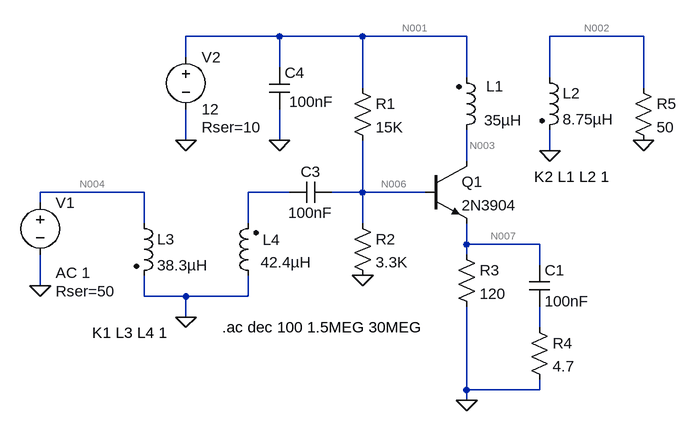
[diagram p0: schematic 2n3904 2_amp.asc]
2n3904 2_amp.asc, the LTspice schematic file:
Version 4
SHEET 1 976 740
WIRE -16 112 -160 112
WIRE 112 112 -16 112
WIRE 272 112 112 112
WIRE 544 112 400 112
WIRE -160 144 -160 112
WIRE -16 160 -16 112
WIRE 272 176 272 112
WIRE 400 176 400 112
WIRE 112 192 112 112
WIRE 544 192 544 112
WIRE -160 272 -160 224
WIRE -16 272 -16 224
WIRE 400 288 400 256
WIRE 272 304 272 256
WIRE -224 352 -384 352
WIRE 0 352 -64 352
WIRE 112 352 112 272
WIRE 112 352 64 352
WIRE 208 352 112 352
WIRE -384 368 -384 352
WIRE -224 400 -224 352
WIRE -64 400 -64 352
WIRE 112 400 112 352
WIRE 272 432 272 400
WIRE 384 432 272 432
WIRE 272 448 272 432
WIRE 384 464 384 432
WIRE -384 496 -384 448
WIRE -224 512 -224 480
WIRE -160 512 -224 512
WIRE -64 512 -64 480
WIRE -64 512 -160 512
WIRE -160 544 -160 512
WIRE 384 560 384 528
WIRE 272 656 272 528
WIRE 384 656 384 640
WIRE 384 656 272 656
WIRE 272 672 272 656
FLAG -384 496 0
FLAG 112 480 0
FLAG 272 672 0
FLAG 400 288 0
FLAG -16 272 0
FLAG 544 272 0
FLAG -160 272 0
FLAG -160 544 0
SYMBOL voltage -384 352 R0
WINDOW 123 24 124 Left 2
WINDOW 39 24 152 Left 2
SYMATTR Value2 AC 1
SYMATTR SpiceLine Rser=50
SYMATTR InstName V1
SYMATTR Value ""
SYMBOL res 96 176 R0
SYMATTR InstName R1
SYMATTR Value 15K
SYMBOL res 96 384 R0
SYMATTR InstName R2
SYMATTR Value 3.3K
SYMBOL res 256 432 R0
SYMATTR InstName R3
SYMATTR Value 120
SYMBOL npn 208 304 R0
SYMATTR InstName Q1
SYMATTR Value 2N3904
SYMBOL cap 64 336 R90
WINDOW 0 0 32 VBottom 2
WINDOW 3 32 32 VTop 2
SYMATTR InstName C3
SYMATTR Value 100nF
SYMBOL ind2 256 272 M180
WINDOW 0 46 83 Left 2
WINDOW 3 43 31 Left 2
SYMATTR InstName L1
SYMATTR Value 35µH
SYMATTR Type ind
SYMBOL ind2 384 160 R0
SYMATTR InstName L2
SYMATTR Value 8.75µH
SYMATTR Type ind
SYMBOL cap -32 160 R0
WINDOW 3 31 53 Left 2
SYMATTR Value 100nF
SYMATTR InstName C4
SYMBOL res 528 176 R0
SYMATTR InstName R5
SYMATTR Value 50
SYMBOL voltage -160 128 R0
WINDOW 123 0 0 Left 0
WINDOW 39 24 124 Left 2
SYMATTR SpiceLine Rser=10
SYMATTR InstName V2
SYMATTR Value 12
SYMBOL cap 368 464 R0
SYMATTR InstName C1
SYMATTR Value 100nF
SYMBOL ind2 -240 384 R0
SYMATTR InstName L3
SYMATTR Value 38.3µH
SYMATTR Type ind
SYMBOL ind2 -48 496 R180
WINDOW 0 -33 71 Left 2
WINDOW 3 -81 36 Left 2
SYMATTR InstName L4
SYMATTR Value 42.4µH
SYMATTR Type ind
SYMBOL res 368 544 R0
SYMATTR InstName R4
SYMATTR Value 4.7
TEXT 376 328 Left 2 !K2 L1 L2 1
TEXT -104 560 Left 2 !.ac dec 100 1.5MEG 30MEG
TEXT -304 568 Left 2 !K1 L3 L4 1

The netlist it stands for:
* 2n3904 2_amp.asc
V1 N004 0 AC 1 Rser=50
R1 N001 N006 15K
R2 N006 0 3.3K
R3 N007 0 120
Q1 N003 N006 N007 0 2N3904
C3 N006 N005 100nF
L1 N003 N001 35µH
L2 N002 0 8.75µH
C4 N001 0 100nF
R5 N002 0 50
V2 N001 0 12 Rser=10
C1 N007 N008 100nF
L3 N004 0 38.3µH
L4 0 N005 42.4µH
R4 N008 0 4.7
.model NPN NPN
.model PNP PNP
.lib standard.bjt
K2 L1 L2 1
.ac dec 100 1.5MEG 30MEG
K1 L3 L4 1
.backanno
.end

* Results of the author's LTspice run, read from the files saved beside the schematic
* Operating Point, zero values left out:
*   V(n001) = 11.88 V
*   V(n006) = 2.05 V
*   V(n007) = 1.332 V
*   V(n003) = 11.88 V
*   Ic(Q1) = 11.07 mA
*   Ib(Q1) = 34.44 µA
*   Ie(Q1) = -11.1 mA
*   I(L1) = -11.07 mA
*   I(R3) = 11.1 mA
*   I(R2) = 621.1 µA
*   I(R1) = 655.5 µA
*   I(V2) = -11.72 mA
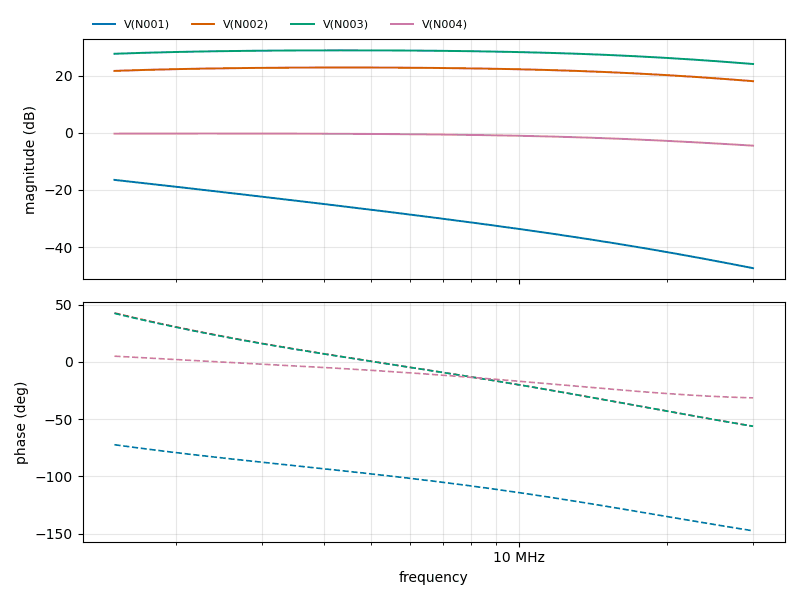
[diagram p1: AC Analysis of 2n3904 2_amp.asc, plotted from the saved traces]
* AC Analysis, 1 run:
*   V(N001): -16.49 dB at 1.5 MHz, -47.42 dB at 30 MHz, peak -16.49 dB at 1.5 MHz, 3 dB below the peak at 2.148 MHz
*   V(N002): 21.69 dB at 1.5 MHz, 18.09 dB at 30 MHz, peak 22.88 dB at 4.427 MHz, 3 dB below the peak at 21.59 MHz
*   V(N003): 27.69 dB at 1.5 MHz, 24.11 dB at 30 MHz, peak 28.90 dB at 4.427 MHz, 3 dB below the peak at 21.6 MHz
*   V(N004): -0.29 dB at 1.5 MHz, -4.50 dB at 30 MHz, peak -0.25 dB at 2.323 MHz, 3 dB below the peak at 22.48 MHz